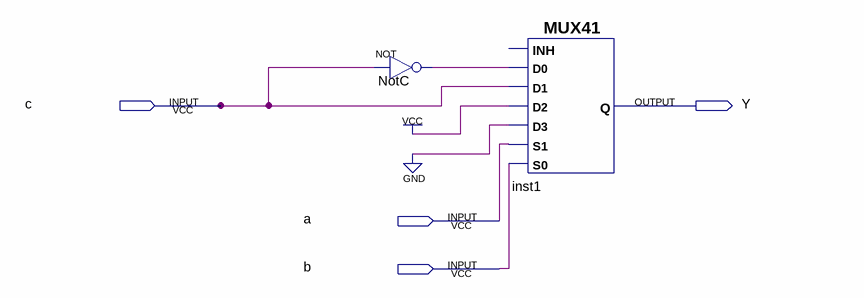
[diagram p0: schematic sheet]
// Quartus schematic exercise10.bdf as structural Verilog: 2 symbols, 4 pins
module exercise10 (
  input  c,
  input  a,
  input  b,
  output Y
);

  wire NotC_out;

  not NotC (NotC_out, c);
  MUX41 inst1 (.S0(b), .D2(1'b1), .S1(a), .D3(1'b0), .D0(NotC_out), .D1(c), .Q(Y));  // open: INH
endmodule
